# EAGLE design SparkFun_STA540_Audio_Amp (EAGLE 5.00)
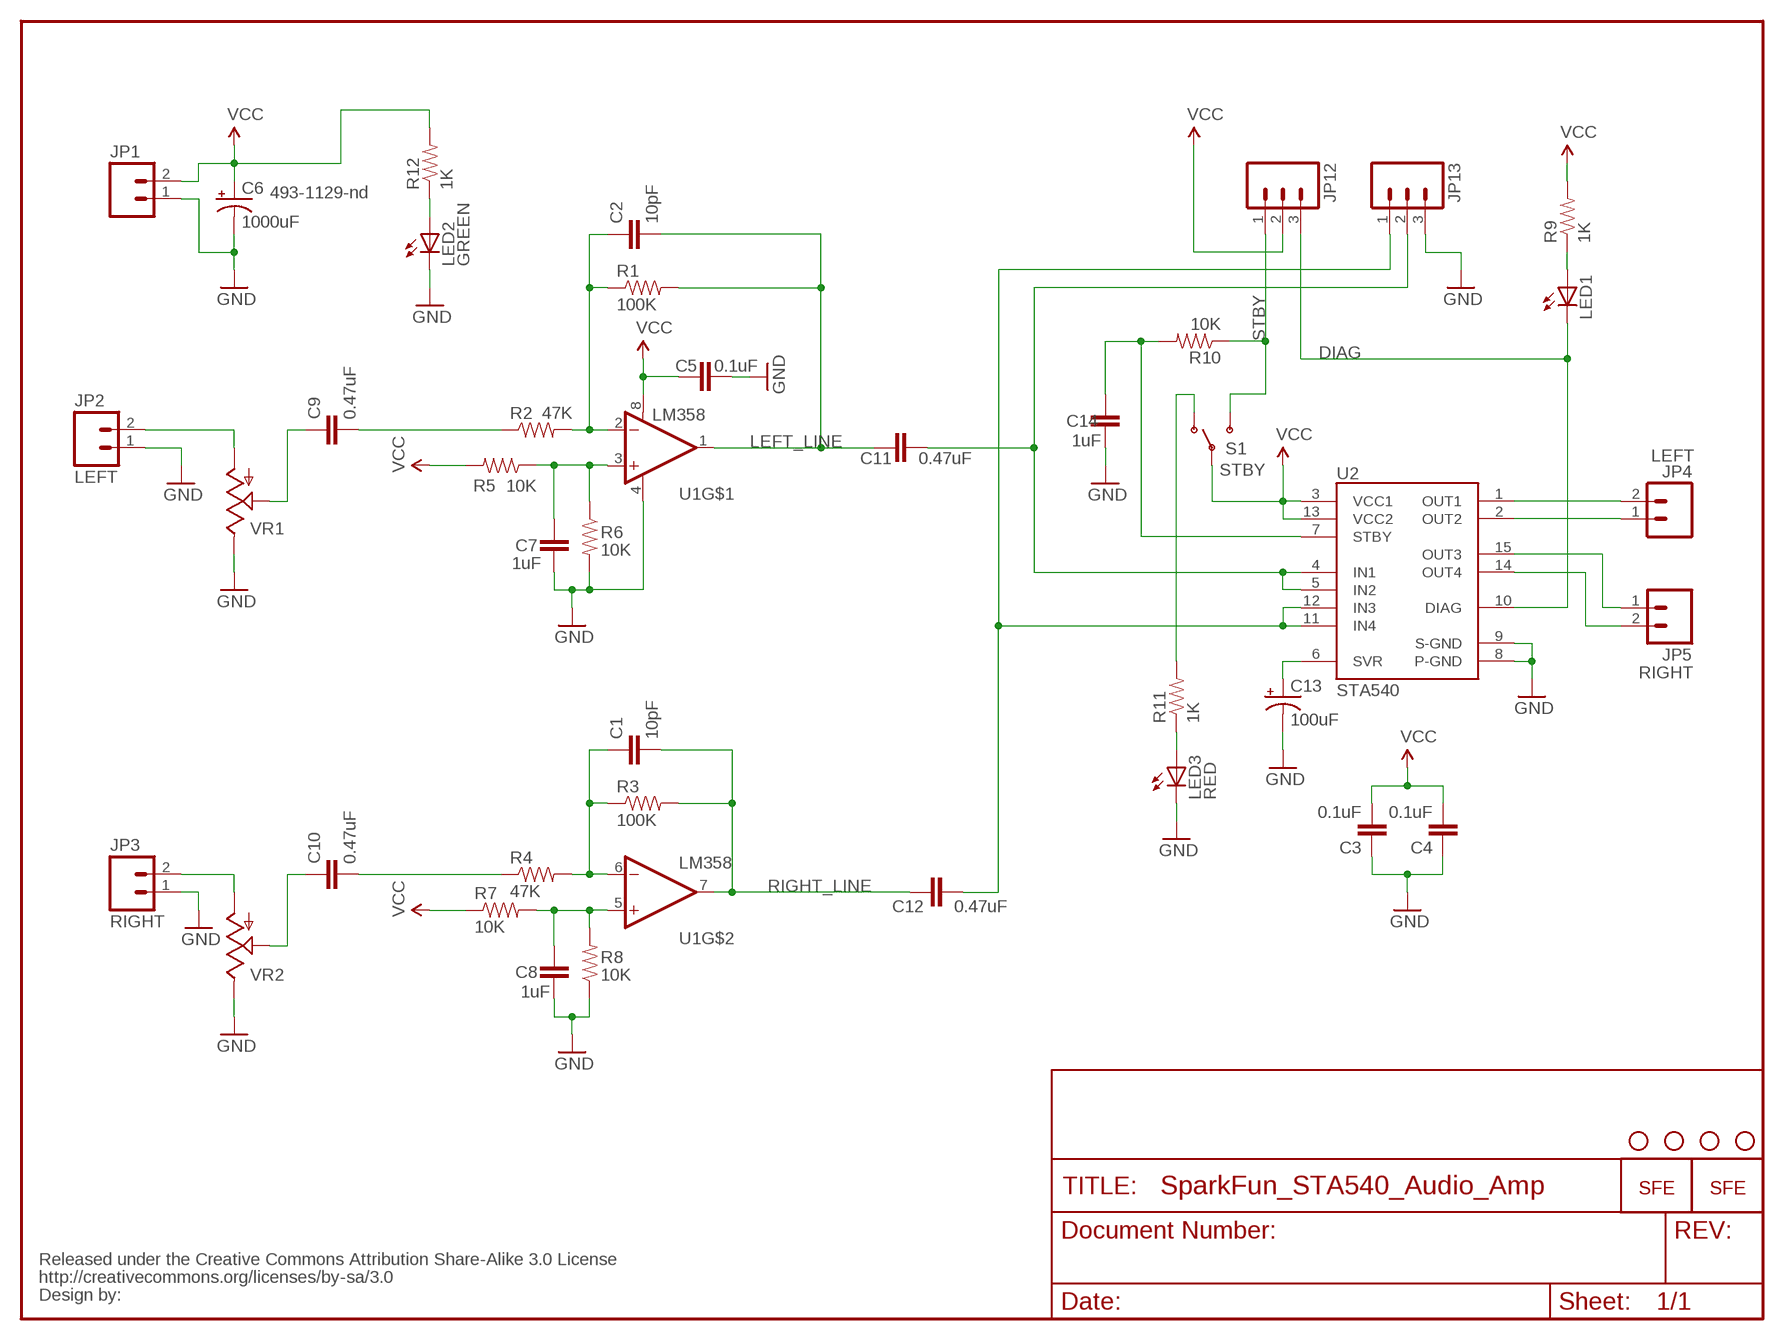
[diagram p0: schematic, sheet 1]

## Parts
C1  10pF  CAPPTH2  [CAP-PTH-SMALL2]
C2  10pF  CAPPTH2  [CAP-PTH-SMALL2]
C3  0.1uF  CAPPTH2  [CAP-PTH-SMALL2]
C4  0.1uF  CAPPTH2  [CAP-PTH-SMALL2]
C5  0.1uF  CAPPTH2  [CAP-PTH-SMALL2]
C6  1000uF  CAP_POLPTH4  [CPOL-RADIAL-1000UF-25V]
C7  1uF  CAPPTH2  [CAP-PTH-SMALL2]
C8  1uF  CAPPTH2  [CAP-PTH-SMALL2]
C9  0.47uF  CAPPTH2  [CAP-PTH-SMALL2]
C10  0.47uF  CAPPTH2  [CAP-PTH-SMALL2]
C11  0.47uF  CAPPTH2  [CAP-PTH-SMALL2]
C12  0.47uF  CAPPTH2  [CAP-PTH-SMALL2]
C13  100uF  CAP_POLPTH1  [CPOL-RADIAL-100UF-25V]
C14  1uF  CAPPTH2  [CAP-PTH-SMALL2]
JP1  M023.5MM_LOCK  [SCREWTERMINAL-3.5MM-2_LOCK]
JP2  M023.5MM_LOCK  [SCREWTERMINAL-3.5MM-2_LOCK]
JP3  M023.5MM_LOCK  [SCREWTERMINAL-3.5MM-2_LOCK]
JP4  M023.5MM_LOCK  [SCREWTERMINAL-3.5MM-2_LOCK]
JP5  M023.5MM_LOCK  [SCREWTERMINAL-3.5MM-2_LOCK]
JP6  LOGO-SFESK  [SFE-LOGO-FLAME]
JP7  STAND-OFF  [STAND-OFF]
JP8  STAND-OFF  [STAND-OFF]
JP9  STAND-OFF  [STAND-OFF]
JP10  STAND-OFF  [STAND-OFF]
JP11  LOGO-SFENEW  [SFE-NEW-WEBLOGO]
JP12  M03PTH  [1X03]
JP13  M03PTH  [1X03]
LED1  LED3MM  [LED3MM]
LED2  GREEN  LED3MM  [LED3MM]
LED3  RED  LED3MM  [LED3MM]
R1  100K  RESISTORPTH1  [AXIAL-0.3]
R2  47K  RESISTORPTH1  [AXIAL-0.3]
R3  100K  RESISTORPTH1  [AXIAL-0.3]
R4  47K  RESISTORPTH1  [AXIAL-0.3]
R5  10K  RESISTORPTH1  [AXIAL-0.3]
R6  10K  RESISTORPTH1  [AXIAL-0.3]
R7  10K  RESISTORPTH1  [AXIAL-0.3]
R8  10K  RESISTORPTH1  [AXIAL-0.3]
R9  1K  RESISTORPTH1  [AXIAL-0.3]
R10  10K  RESISTORPTH1  [AXIAL-0.3]
R11  1K  RESISTORPTH1  [AXIAL-0.3]
R12  1K  RESISTORPTH1  [AXIAL-0.3]
S1  STBY  SWITCH-SPSTPTH  [SWITCH-SPDT]
U1  LM358  [DIP08]
U2  STA540  STA5406400BG_W/SOLDERPOSTS  [MULTIWATT15_6400BGHEATSINK_2]
U$1  CREATIVE_COMMONS  [CREATIVE_COMMONS]
VR1  10K  POT  [ALPS_POT]
VR2  10K  POT  [ALPS_POT]

## Nets
DIAG: JP12.3 LED1.K(C) U2.10(DIAG)
GND: C3.1 C4.1 C5.1 C6.2(-) C7.2 C8.2 C13.2(-) C14.2 JP1.1 JP2.1 JP3.1 JP13.3 LED2.K(C) LED3.K(C) R6.P$2 R8.P$1 U1.4(V-) U2.8(P-GND) U2.9(S-GND) VR1.P$1(E) VR2.P$1(E)
LEFT_LINE: C2.2 C11.1 R1.P$2 U1.1(OUT)
N$1: C9.1 VR1.P$2(S)
N$2: JP2.2 VR1.P$3(A)
N$3: C9.2 R2.P$1
N$4: C2.1 R1.P$1 R2.P$2 U1.2(-IN)
N$5: C7.1 R5.P$1 R6.P$1 U1.3(+IN)
N$6: LED3.A R11.P$1
N$7: R11.P$2 S1.1(O)
N$8: JP3.2 VR2.P$3(A)
N$9: C10.1 VR2.P$2(S)
N$10: C8.1 R7.P$2 R8.P$2 U1.5(+IN)
N$11: C10.2 R4.P$1
N$12: LED1.A R9.P$1
N$13: C1.1 R3.P$1 R4.P$2 U1.6(-IN)
N$14: LED2.A R12.P$1
N$15: JP4.1 U2.2(OUT2)
N$16: JP4.2 U2.1(OUT1)
N$18: JP5.2 U2.14(OUT4)
N$19: JP5.1 U2.15(OUT3)
N$20: C11.2 JP13.2 U2.4(IN1) U2.5(IN2)
N$21: C12.2 JP13.1 U2.11(IN4) U2.12(IN3)
N$22: C13.1(+) U2.6(SVR)
N$23: C14.1 R10.P$2 U2.7(STBY)
RIGHT_LINE: C1.2 C12.1 R3.P$2 U1.7(OUT)
STBY: JP12.1 R10.P$1 S1.3(S)
VCC: C3.2 C4.2 C5.2 C6.1(+) JP1.2 JP12.2 R5.P$2 R7.P$1 R9.P$2 R12.P$2 S1.2(P) U1.8(V+) U2.3(VCC1) U2.13(VCC2)

## Notes on the sheet
- 493-1129-nd
- LEFT
- LEFT
- RIGHT
- RIGHT

## Library data of the parts
C1-C5 C7-C12 C14 = SparkFun:CAP: Capacitor Standard 0603 ceramic capacitor, and 0.1" leaded capacitor.
C6 C13 = SparkFun:CAP_POL: Capacitor Polarized These are standard SMD and PTH capacitors. Normally 10uF, 47uF, and 100uF in electrolytic and tantalum varieties. Always verify the external diameter of the through hole cap, it varies with capacity, voltage, and manufacturer. The EIA devices should be standard.
JP1-JP5 = SparkFun:M02: Header 2 Standard 2-pin 0.1" header. Use with straight break away headers (SKU : PRT-00116), right angle break away headers (PRT-00553), swiss pins (PRT-00743), machine pins (PRT-00117), and female headers (PRT-00115). Molex polarized connector foot print use with SKU : PRT-08233 with associated crimp pins and housings.
JP6 JP11 = SparkFun:LOGO-SFE: Spark Fun Electronics PCB Logo This is the standard Spark Fun Electronics PCB logo.
JP7-JP10 = SparkFun:STAND-OFF: Stand Off This is the mechanical footprint for a #4 phillips button head screw. Use the keepout ring to avoid running the screw head into surrounding components. SKU : PRT-00447
JP12 JP13 = SparkFun:M03: Header 3 Standard 3-pin 0.1" header. Use with straight break away headers (SKU : PRT-00116), right angle break away headers (PRT-00553), swiss pins (PRT-00743), machine pins (PRT-00117), and female headers (PRT-00115). Molex polarized connector foot print use with SKU : PRT-08232 with associated crimp pins and housings.
LED1-LED3 = SparkFun:LED: LEDs Standard schematic elements and footprints for 5mm, 3mm, 1206, and 0603 sized LEDs. 5mm - Spark Fun Electronics SKU : COM-00529 (and others)
R1-R12 = SparkFun:RESISTOR: Resistor Basic schematic elements and footprints for 0603, 1206, and PTH 1/10th watt (small) resistors.
S1 = SparkFun:SWITCH-SPST: SPST Switch Simple slide switch. Spark Fun Electronics SKU : COM-00102
U1 = SparkFun:LM358
U2 = SparkFun:STA540
U$1 = SparkFun:CREATIVE_COMMONS
VR1 VR2 = SparkFun:POT

## Board
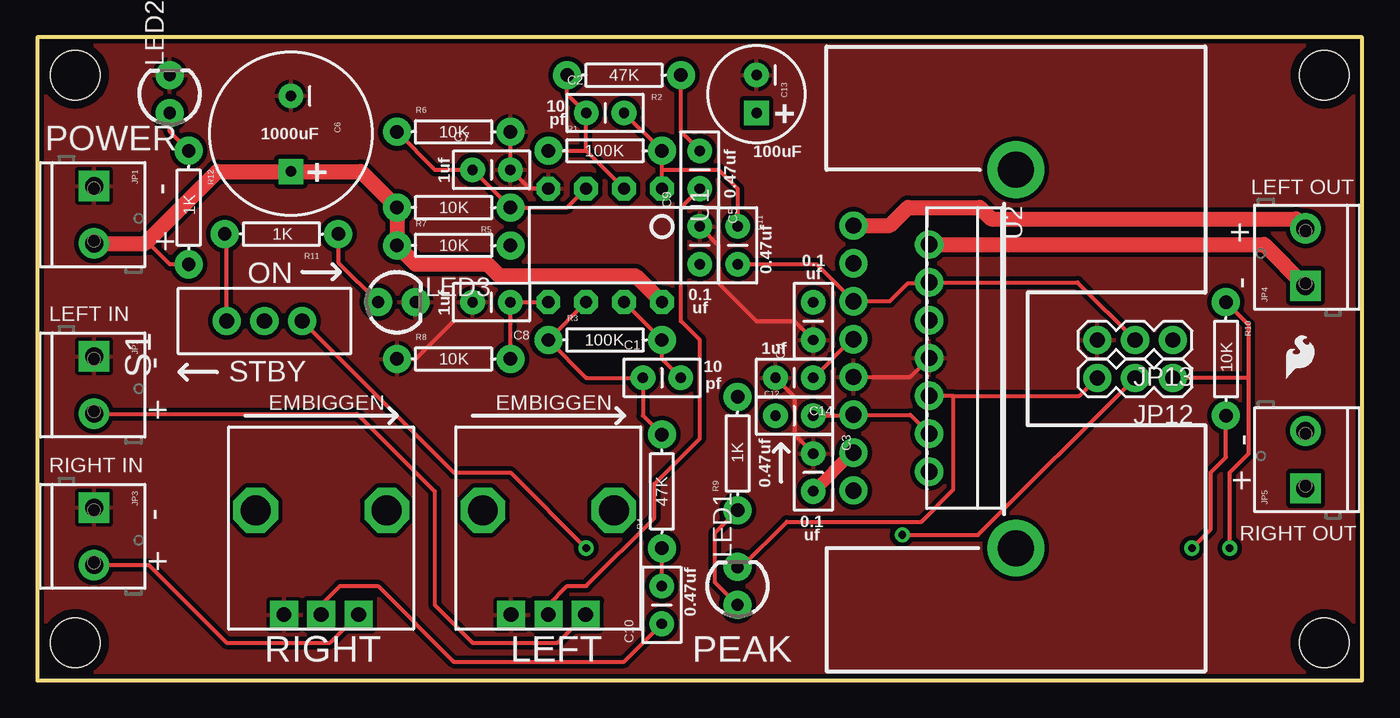
[diagram p1: board, top side]
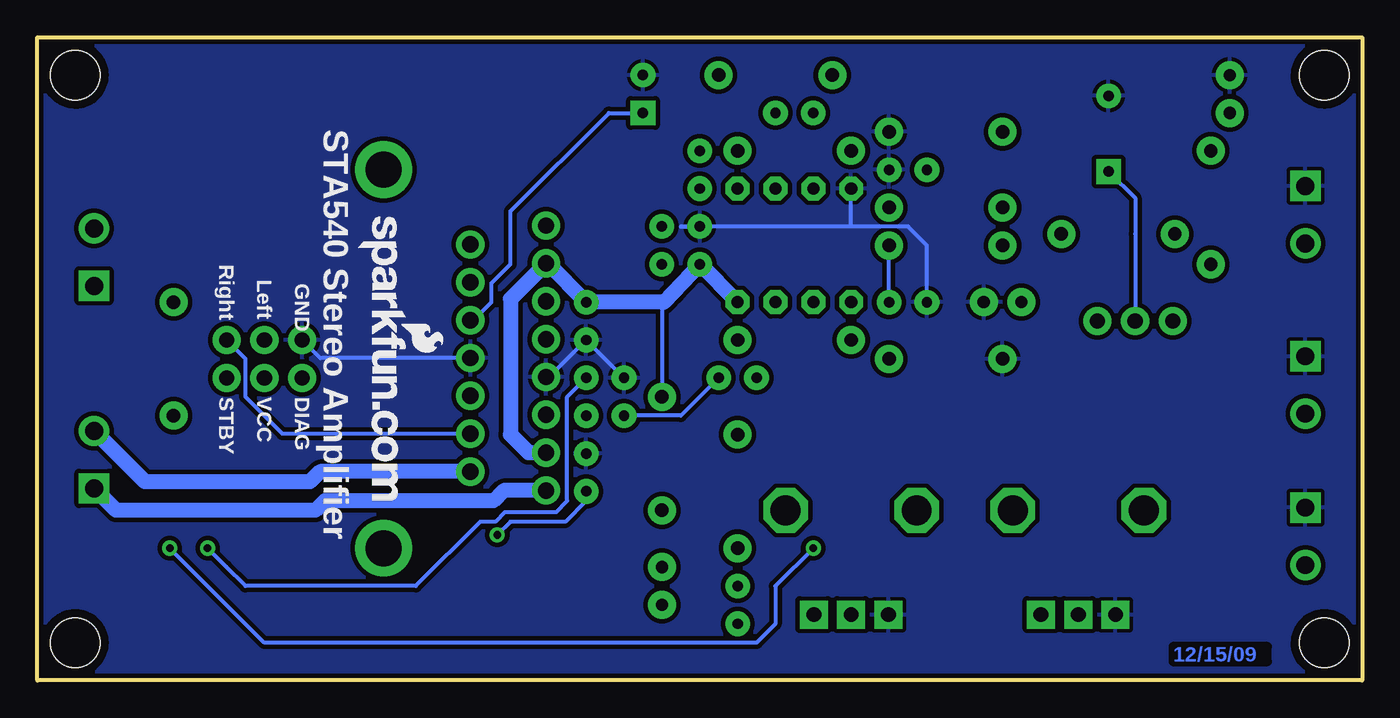
[diagram p2: board, bottom side, seen from below]

Size 88.9 x 43.16 mm. Coordinates in mm from the lower left corner, seen from the top.
Outline: 0,43.16 0,0 88.9,0 88.9,43.16 0,43.16
Copper layers (1*16): Top 0.035mm / dielectric 1.5mm / Bottom 0.035mm
Design rules "SparkFun": minimum track width 8mil, minimum drill 20mil, track to track 8mil, track to pad 8mil, pad to pad 8mil, via to via 8mil, smd to smd 8mil, copper to edge 9mil, drill to drill 8mil, minimum pad ring 12mil, minimum via ring 10mil, stop-mask expansion 4mil, vias tented up to drill 20mil, thermal gap 10mil

### Footprints (pad centres in the part's own frame; a part is rotated, then mirrored left to right if it is on the bottom)
CAP-PTH-SMALL2 = drill 0.7 pad 1.651 round: 1 0,0; 2 2.54,0
CPOL-RADIAL-1000UF-25V = drill 0.7 pad 1.651 square: 1 2.54,0 | drill 0.7 pad 1.651 round: 2 -2.54,0
CPOL-RADIAL-100UF-25V = drill 0.7 pad 1.651 square: 1 1.27,0 | drill 0.7 pad 1.651 round: 2 -1.27,0
SCREWTERMINAL-3.5MM-2_LOCK = drill 1.2 pad 2.032 square: 1 -0.178,0 | drill 1.2 pad 2.032 round: 2 3.678,0
STAND-OFF = hole 3.302: 0,0
1X03 = drill 1.016 pad 1.88 round: 1 0,0; 2 2.54,0; 3 5.08,0
LED3MM = drill 0.813 pad 1.88 round: A -1.27,0; K 1.27,0
AXIAL-0.3 = drill 0.9 pad 1.88 round: P$1 -3.81,0; P$2 3.81,0
SWITCH-SPDT = drill 1.016 pad 1.88 round: 1 0,2.54; 2 0,0; 3 0,-2.54
DIP08 = drill 0.813 pad 1.6 octagon: 1 -3.81,-3.81; 2 -1.27,-3.81; 3 1.27,-3.81; 4 3.81,-3.81; 5 3.81,3.81; 6 1.27,3.81; 7 -1.27,3.81; 8 -3.81,3.81
MULTIWATT15_6400BGHEATSINK_2 = drill 1.1 pad 1.9 round: 1 -8.95,-2.39; 2 -7.68,2.69; 3 -6.41,-2.39; 4 -5.14,2.69; 5 -3.87,-2.39; 6 -2.6,2.69; 7 -1.33,-2.39; 8 -0.06,2.69; 9 1.21,-2.39; 10 2.48,2.69; 11 3.75,-2.39; 12 5.02,2.69; 13 6.29,-2.39; 14 7.56,2.69; 15 8.83,-2.39 | drill 2.413 pad 3.81 round: P$1 -12.7,8.509; P$2 12.7,8.509
ALPS_POT = drill 1 pad 1.88 square: P$1 7,-2.5; P$2 7,0; P$3 7,2.5 | drill 2 octagon: P$4 0,-4.4; P$5 0,4.4

### Placement (x,y rotation side)
C1  40.64,20.3 0 top
C2  36.83,38.08 0 top
C3  52.07,15.22 270 top
C4  52.07,22.84 90 top
C5  44.45,30.46 270 top
C6  17.02,36.68 270 top
C7  29.21,34.27 0 top
C8  31.75,25.38 180 top
C9  44.45,33 90 top
C10  41.91,3.79 90 top
C11  46.99,30.46 270 top
C12  49.53,17.76 0 top
C13  48.26,39.35 270 top
C14  52.07,20.3 180 top
JP1  3.81,33 270 top
JP2  3.81,21.57 270 top
JP3  3.81,11.41 270 top
JP4  85.09,26.65 90 top
JP5  85.09,13.06 90 top
JP6  83.82,20.3 0 top
JP7  2.54,40.62 270 top
JP8  2.54,2.52 270 top
JP9  86.36,2.52 0 top
JP10  86.36,40.62 0 top
JP11  67.34,31.1 270 bottom
JP12  76.2,20.3 180 top
JP13  76.2,22.84 180 top
LED1  46.99,6.33 90 top
LED2  8.89,39.35 90 top
LED3  24.13,25.38 0 top
R1  38.1,35.54 0 top
R2  39.37,40.62 180 top
R3  38.1,22.84 0 top
R4  41.91,12.68 90 top
R5  27.94,31.73 180 top
R6  27.94,36.81 0 top
R7  27.94,29.19 0 top
R8  27.94,21.57 0 top
R9  46.99,15.22 90 top
R10  79.76,21.57 270 top
R11  16.38,29.95 180 top
R12  10.16,31.73 270 top
S1  15.24,24.11 90 top
U1  38.1,29.19 180 top
U2  57.15,21.57 270 top
U$1  20.32,-8.91 0 top  (outside the outline)
VR1  34.29,11.41 270 top
VR2  19.05,11.41 270 top

### Tracks (layer width: path | path; a pad name or v marks a point on that pad's centre or on a via)
DIAG
  Top 0.254: 61.47,19.09 U2.10 | 61.47,19.09 61.47,12.81 59.31,10.65 50.29,10.65 47.24,7.6 LED1.K | 61.47,19.09 69.91,19.09 JP12.3
GND
  Top 0.254: R6.P$2 C7.2 33.02,33 U1.4 | U2.9 58.57,20.36 U2.8 | C5.1 45.72,29.19 45.72,26.65 48.26,24.11 50.8,24.11 C4.1 | C3.1 50.8,16.49 50.8,19.03 C14.2 | R8.P$1 25.4,21.57 27.94,24.11
  Bottom 0.254: 34.29,30.46 U1.4 | C14.2 C4.1 54.55,20.36 U2.9 | 34.29,30.46 C5.1 | C8.2 29.21,29.19 30.48,30.46 34.29,30.46 | U2.8 69.91,21.63 JP13.3
  Bottom 0.305: C5.1 45.72,30.46
  pour Top (isolate 0.305): 0,-0.02 88.9,-0.02 88.9,43.16 0,43.16
  pour Bottom (isolate 0.305): 0,-0.02 88.9,-0.02 88.9,43.16 0,43.16
LEFT_LINE
  Top 0.254: 41.91,34.27 R1.P$2 C2.2 | U1.1 41.91,34.27 | 41.91,34.27 45.72,34.27 46.99,33 C11.1
N$1
  Top 0.254: VR1.P$2 34.29,5.06 35.56,6.33 36.83,6.33 41.4,10.9 41.4,13.19 44.45,16.24 44.45,22.84 43.18,24.11 43.18,31.73 C9.1
N$2
  Top 0.254: JP2.2 21.46,17.89 26.67,12.68 26.67,5.06 29.21,2.52 34.9,2.52 VR1.P$3
N$3
  Top 0.254: R2.P$1 43.18,36.81 C9.2
N$4
  Top 0.254: R1.P$1 36.83,35.54 | 36.83,35.54 C2.1 35.56,39.35 R2.P$2 | 36.83,35.54 U1.2
N$5
  Top 0.254: U1.3 35.56,31.73 R5.P$1 C7.1 26.67,34.27 R6.P$1
N$6
  Top 0.254: R11.P$1 20.19,28.05 LED3.A
N$7
  Top 0.254: S1.1 12.7,29.82 R11.P$2
N$8
  Top 0.254: JP3.2 7.49,7.73 12.7,2.52 19.66,2.52 VR2.P$3
N$9
  Top 0.254: VR2.P$2 19.05,5.06 20.32,6.33 22.86,6.33 27.94,1.25 39.37,1.25 C10.1
N$10
  Top 0.254: R8.P$2 C8.1 U1.5
  Bottom 0.254: C8.1 R7.P$2
N$11
  Top 0.254: C10.2 R4.P$1
N$12
  Top 0.254: R9.P$1 45.47,9.89 45.47,6.58 LED1.A
N$13
  Top 0.254: R4.P$2 40.64,17.76 C1.1 36.83,20.3 R3.P$1 U1.6
N$14
  Top 0.254: LED2.A 8.89,36.81 R12.P$1
N$15
  Top 1.016: U2.2 82.31,29.25 JP4.1
N$16
  Top 1.016: U2.1 57.21,30.52 58.42,31.73 63.25,31.73 64.01,30.97 84.45,30.97 JP4.2
N$18
  Bottom 1.016: U2.14 69.92,14.01 70.61,13.32 81.67,13.32 JP5.2
N$19
  Bottom 1.016: U2.15 57.6,12.74 58.29,12.04 69.6,12.04 70.23,11.41 83.62,11.41 JP5.1
N$20
  Top 0.254: C11.2 52.28,27.92 U2.5 57.21,25.44 58.42,26.65 59.78,26.65 U2.4 69.79,26.71 JP13.2
N$21
  Top 0.254: U2.12 58.57,17.82 U2.11 54.7,17.76 C12.2
  Bottom 0.254: U2.12 72.45,16.55 74.93,19.03 74.93,21.57 JP13.1
N$22
  Bottom 0.254: U2.6 59.63,24.17 58.42,25.38 58.42,26.65 57.15,27.92 57.15,31.48 50.55,38.08 C13.1
N$23  (via drill 0.51)
  Top 0.254: U2.7 54.67,22.9 C14.1 | R10.P$2 79.76,14.97 78.74,13.95 78.74,10.14 v77.47,8.87
  Bottom 0.254: C14.1 53.34,19.03 53.34,12.04 54.1,11.28 57.53,11.28 58.17,10.65 59.18,10.65 63.5,6.33 74.93,6.33 76.26,7.66 | 76.26,7.66 v77.47,8.87 | 76.26,7.66 76.2,7.6
RIGHT_LINE
  Top 0.254: U1.7 R3.P$2 41.91,21.57 C1.2
  Bottom 0.254: C12.1 45.72,17.76 C1.2
STBY  (via drill 0.51)
  Top 0.254: v36.83,8.87 31.75,13.95 27.94,13.95 S1.3 | v80.01,8.87 80.01,13.95 81.28,15.22 81.28,20.3 | 81.28,20.3 81.28,23.86 R10.P$1 | 81.28,20.3 JP12.1
  Bottom 0.254: v36.83,8.87 39.37,6.33 39.37,3.79 40.64,2.52 73.66,2.52 v80.01,8.87
VCC  (via drill 0.51)
  Top 0.254: v58.04,9.76 63.12,9.76 JP12.2 | R12.P$2 8.89,27.92 7.37,29.44
  Top 0.813: U2.13 54.67,15.28 C3.2
  Top 1.016: U1.8 40.13,27.16 30.99,27.16 30.23,27.92 25.4,27.92 R7.P$1 R5.P$2 21.72,34.14 C6.1 12.06,34.14 7.37,29.44 7.24,29.32 JP1.2
  Bottom 0.254: C3.2 52.07,12.04 53.47,10.65 57.15,10.65 v58.04,9.76 | 46.99,25.38 R9.P$2 | S1.2 15.24,29.95 15.24,32.36 C6.1
  Bottom 0.813: 54.7,27.92 U2.3
  Bottom 1.016: U1.8 C5.2 46.23,26.02 46.86,25.38 46.99,25.38 C4.2 54.61,27.92 54.7,27.92 | U2.13 55.94,15.28 57.15,16.49 57.15,25.59 U2.3

### Text on the board
Bottom: 12/15/09
tPlace: 10 | pf | + | POWER | 1000uF | 100uF | - | + | 1uf | LEFT OUT | 0.47uf | + | + | 0.1 | ON | 0.47uf | uf | 0.1 | - | 1uf | uf | LEFT IN | 1uf | - | 10 | STBY | pf | + | EMBIGGEN | EMBIGGEN | 0.47uf | - | RIGHT IN | + | - | 0.1 | + | uf | RIGHT OUT | 0.47uf | RIGHT | LEFT | PEAK
bPlace: STA540 Stereo Amplifier | Right | GND | Left | DIAG | VCC | STBY